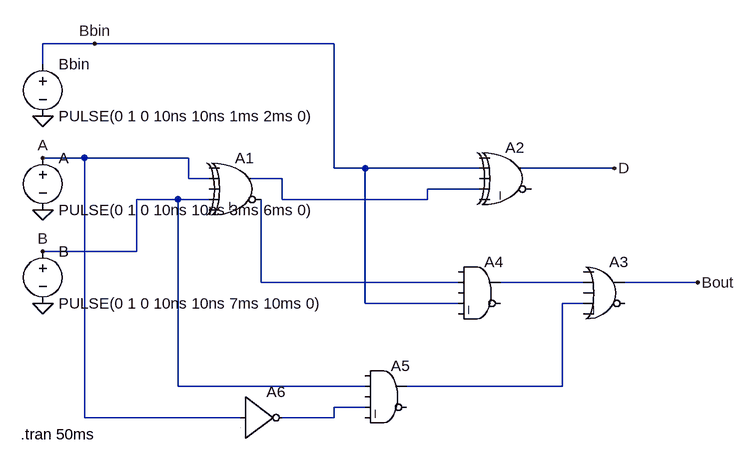
[diagram p0: schematic Tp Sub.asc]
Tp Sub.asc, the LTspice schematic file:
Version 4
SHEET 1 880 680
WIRE -640 -256 -720 -256
WIRE -272 -256 -640 -256
WIRE -720 -224 -720 -256
WIRE -656 -80 -720 -80
WIRE -496 -80 -656 -80
WIRE -272 -64 -272 -256
WIRE -224 -64 -272 -64
WIRE -48 -64 -224 -64
WIRE 160 -64 16 -64
WIRE -496 -48 -496 -80
WIRE -464 -48 -496 -48
WIRE -352 -48 -400 -48
WIRE -48 -32 -128 -32
WIRE -512 -16 -576 -16
WIRE -464 -16 -512 -16
WIRE -352 -16 -352 -48
WIRE -128 -16 -128 -32
WIRE -128 -16 -352 -16
WIRE -576 64 -576 -16
WIRE -576 64 -720 64
WIRE -384 112 -384 -16
WIRE -80 112 -384 112
WIRE 112 112 -16 112
WIRE 288 112 176 112
WIRE -224 144 -224 -64
WIRE -80 144 -224 144
WIRE 112 144 80 144
WIRE -512 272 -512 -16
WIRE -224 272 -512 272
WIRE 80 272 80 144
WIRE 80 272 -160 272
WIRE -224 304 -272 304
WIRE -656 320 -656 -80
WIRE -416 320 -656 320
WIRE -272 320 -272 304
WIRE -272 320 -352 320
FLAG -720 -144 0
FLAG -720 144 0
FLAG -720 0 0
FLAG 160 -64 D
FLAG 288 112 Bout
FLAG -640 -256 Bbin
FLAG -720 -80 A
FLAG -720 64 B
SYMBOL Digital\\xor -416 -96 R0
SYMATTR InstName A1
SYMBOL Digital\\xor 0 -112 R0
SYMATTR InstName A2
SYMBOL Digital\\or 144 64 R0
SYMATTR InstName A3
SYMBOL Digital\\and -48 64 R0
SYMATTR InstName A4
SYMBOL Digital\\and -192 224 R0
SYMATTR InstName A5
SYMBOL Digital\\inv -416 256 R0
SYMATTR InstName A6
SYMBOL voltage -720 -96 R0
WINDOW 123 0 0 Left 0
WINDOW 39 0 0 Left 0
SYMATTR InstName A
SYMATTR Value PULSE(0 1 0 10ns 10ns 3ms 6ms 0)
SYMBOL voltage -720 48 R0
WINDOW 123 0 0 Left 0
WINDOW 39 0 0 Left 0
SYMATTR InstName B
SYMATTR Value PULSE(0 1 0 10ns 10ns 7ms 10ms 0)
SYMBOL voltage -720 -240 R0
WINDOW 123 0 0 Left 0
WINDOW 39 0 0 Left 0
SYMATTR InstName Bbin
SYMATTR Value PULSE(0 1 0 10ns 10ns 1ms 2ms 0)
TEXT -754 346 Left 2 !.tran 50ms

The netlist it stands for:
* Tp Sub.asc
A1 0 A 0 B 0 N002 N001 0 XOR
A2 0 Bbin 0 N001 0 0 D 0 XOR
A3 0 N003 0 N004 0 0 Bout 0 OR
A4 0 N002 0 Bbin 0 0 N003 0 AND
A5 0 B 0 N005 0 0 N004 0 AND
A6 A 0 0 0 0 N005 0 0 BUF
V§A A 0 PULSE(0 1 0 10ns 10ns 3ms 6ms 0)
V§B B 0 PULSE(0 1 0 10ns 10ns 7ms 10ms 0)
V§Bbin Bbin 0 PULSE(0 1 0 10ns 10ns 1ms 2ms 0)
.tran 50ms
.backanno
.end